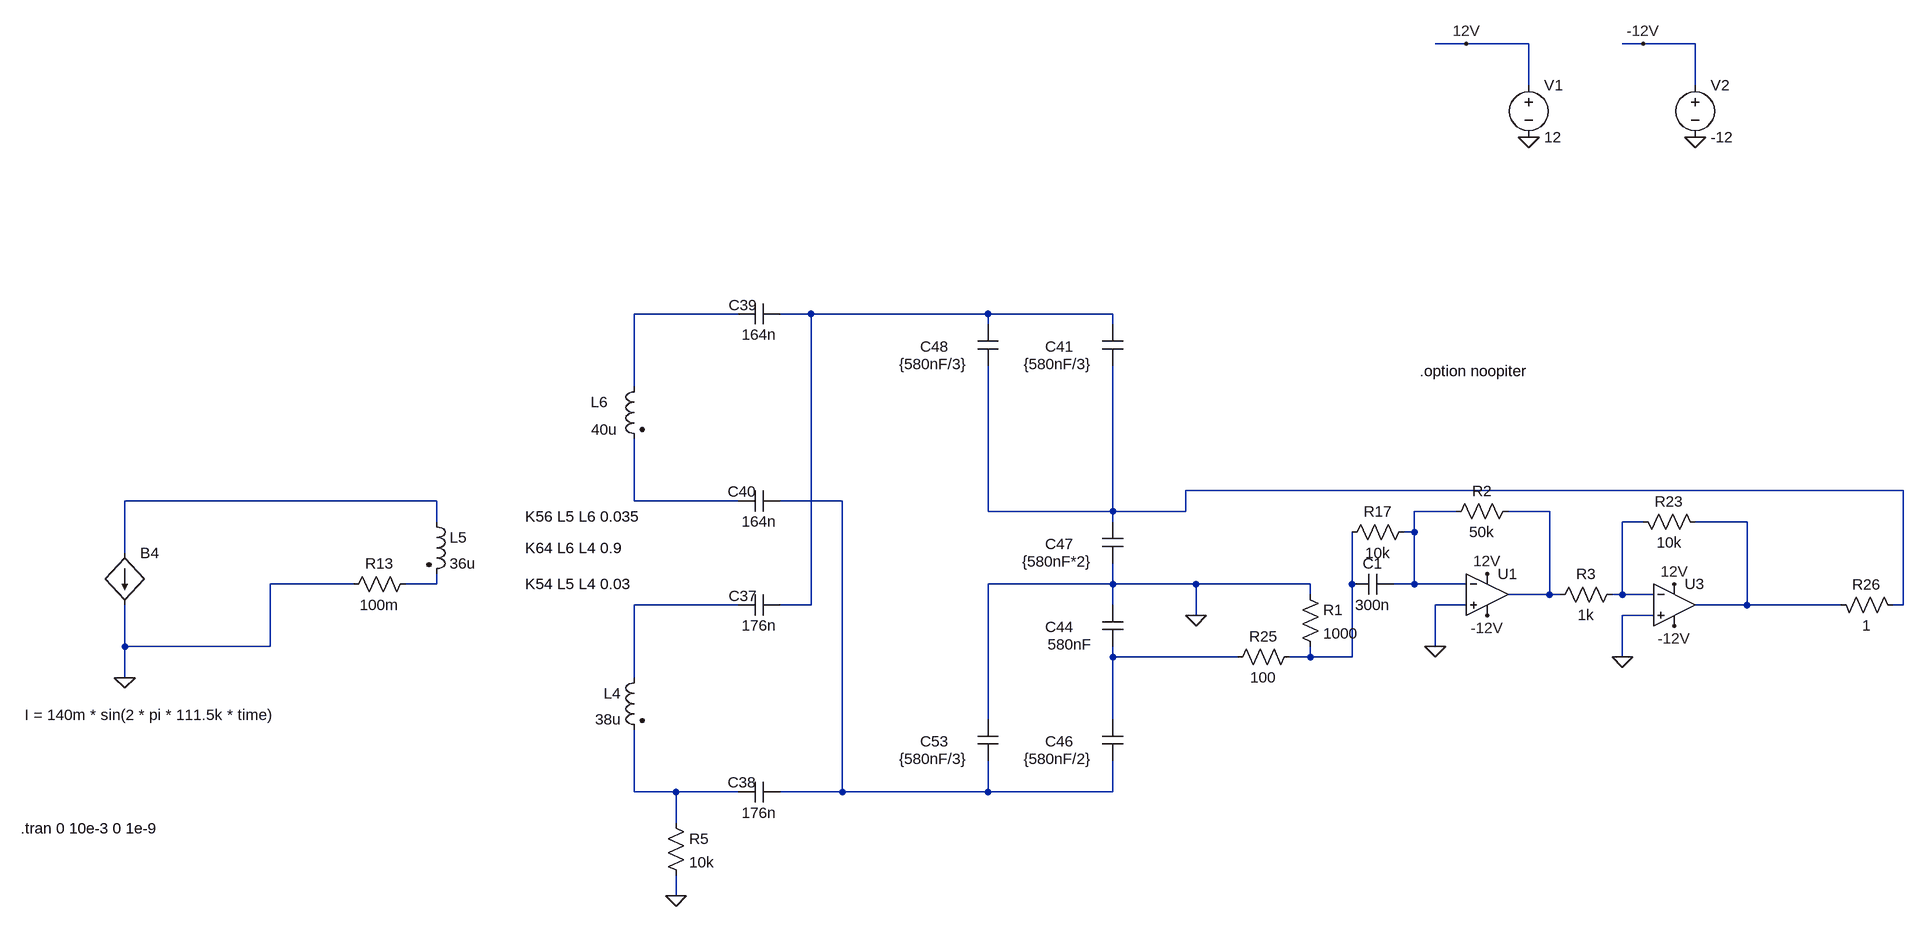
[diagram p0: schematic IMN_DIPS_CANCELATION_test.asc]
IMN_DIPS_CANCELATION_test.asc, the LTspice schematic file:
Version 4
SHEET 1 9932 3220
WIRE 3552 496 3504 496
WIRE 3648 496 3552 496
WIRE 3824 496 3792 496
WIRE 3904 496 3824 496
WIRE 3648 560 3648 496
WIRE 3904 560 3904 496
WIRE 2432 912 2272 912
WIRE 2544 912 2496 912
WIRE 2816 912 2544 912
WIRE 3008 912 2816 912
WIRE 2816 928 2816 912
WIRE 3008 928 3008 912
WIRE 2272 1024 2272 912
WIRE 4224 1184 3120 1184
WIRE 1968 1200 1488 1200
WIRE 2272 1200 2272 1104
WIRE 2432 1200 2272 1200
WIRE 2592 1200 2496 1200
WIRE 2816 1216 2816 992
WIRE 3008 1216 3008 992
WIRE 3008 1216 2816 1216
WIRE 3120 1216 3120 1184
WIRE 3120 1216 3008 1216
WIRE 3536 1216 3472 1216
WIRE 3680 1216 3616 1216
WIRE 1968 1232 1968 1200
WIRE 3008 1232 3008 1216
WIRE 3824 1232 3792 1232
WIRE 3984 1232 3904 1232
WIRE 3472 1248 3472 1216
WIRE 3472 1248 3456 1248
WIRE 1488 1280 1488 1200
WIRE 1840 1328 1712 1328
WIRE 1968 1328 1968 1312
WIRE 1968 1328 1920 1328
WIRE 3008 1328 3008 1296
WIRE 3008 1328 2816 1328
WIRE 3136 1328 3008 1328
WIRE 3312 1328 3136 1328
WIRE 3376 1328 3376 1248
WIRE 3472 1328 3472 1248
WIRE 3472 1328 3440 1328
WIRE 3552 1328 3472 1328
WIRE 3312 1344 3312 1328
WIRE 3680 1344 3680 1216
WIRE 3680 1344 3616 1344
WIRE 3696 1344 3680 1344
WIRE 3792 1344 3792 1232
WIRE 3792 1344 3776 1344
WIRE 3840 1344 3792 1344
WIRE 2432 1360 2272 1360
WIRE 2544 1360 2544 912
WIRE 2544 1360 2496 1360
WIRE 3008 1360 3008 1328
WIRE 3552 1360 3504 1360
WIRE 3984 1360 3984 1232
WIRE 3984 1360 3904 1360
WIRE 4128 1360 3984 1360
WIRE 4224 1360 4224 1184
WIRE 4224 1360 4208 1360
WIRE 3136 1376 3136 1328
WIRE 3840 1376 3792 1376
WIRE 1488 1424 1488 1360
WIRE 1712 1424 1712 1328
WIRE 1712 1424 1488 1424
WIRE 3504 1424 3504 1360
WIRE 3008 1440 3008 1424
WIRE 3200 1440 3008 1440
WIRE 3312 1440 3312 1424
WIRE 3312 1440 3280 1440
WIRE 3376 1440 3376 1328
WIRE 3376 1440 3312 1440
WIRE 3792 1440 3792 1376
WIRE 1488 1472 1488 1424
WIRE 2272 1472 2272 1360
WIRE 2816 1536 2816 1328
WIRE 3008 1536 3008 1440
WIRE 2272 1648 2272 1552
WIRE 2336 1648 2272 1648
WIRE 2432 1648 2336 1648
WIRE 2592 1648 2592 1200
WIRE 2592 1648 2496 1648
WIRE 2816 1648 2816 1600
WIRE 2816 1648 2592 1648
WIRE 3008 1648 3008 1600
WIRE 3008 1648 2816 1648
WIRE 2336 1696 2336 1648
WIRE 2336 1808 2336 1776
FLAG 1488 1472 0
FLAG 3792 1440 0
FLAG 3872 1328 12V
FLAG 3872 1392 -12V
FLAG 3504 1424 0
FLAG 3584 1312 12V
FLAG 3584 1376 -12V
FLAG 3648 640 0
FLAG 3904 640 0
FLAG 3552 496 12V
FLAG 3824 496 -12V
FLAG 3136 1376 0
FLAG 2336 1808 0
SYMBOL ind2 2288 1456 M0
SYMATTR Value 38u
SYMATTR InstName L4
SYMATTR Type ind
SYMATTR SpiceLine Rpar=1MEG
SYMBOL ind2 1952 1216 R0
SYMATTR InstName L5
SYMATTR Value 36u
SYMATTR Type ind
SYMATTR SpiceLine Rpar=1MEG
SYMBOL cap 2432 1376 R270
WINDOW 0 14 7 VTop 2
WINDOW 3 0 32 VBottom 2
SYMATTR InstName C37
SYMATTR Value 176n
SYMATTR SpiceLine Rser=3m
SYMBOL res 1936 1312 R90
WINDOW 0 0 56 VBottom 2
WINDOW 3 32 56 VTop 2
SYMATTR InstName R13
SYMATTR Value 100m
SYMBOL cap 2432 1664 R270
WINDOW 0 15 6 VTop 2
WINDOW 3 0 32 VBottom 2
SYMATTR InstName C38
SYMATTR Value 176n
SYMATTR SpiceLine Rser=3m
SYMBOL ind2 2288 1008 M0
WINDOW 3 42 82 Left 2
WINDOW 0 56 40 Left 2
SYMATTR Value 40u
SYMATTR InstName L6
SYMATTR Type ind
SYMATTR SpiceLine Rpar=1MEG
SYMBOL cap 2432 928 R270
WINDOW 0 14 7 VTop 2
WINDOW 3 0 32 VBottom 2
SYMATTR InstName C39
SYMATTR Value 164n
SYMATTR SpiceLine Rser=3m
SYMBOL cap 2432 1216 R270
WINDOW 0 15 6 VTop 2
WINDOW 3 0 32 VBottom 2
SYMATTR InstName C40
SYMATTR Value 164n
SYMATTR SpiceLine Rser=3m
SYMBOL cap 3024 992 R180
WINDOW 0 76 30 Left 2
WINDOW 3 47 3 Left 2
SYMATTR InstName C41
SYMATTR Value {580nF/3}
SYMATTR SpiceLine Rser=3m
SYMBOL cap 3024 1424 R180
WINDOW 0 76 30 Left 2
WINDOW 3 47 3 Left 2
SYMATTR InstName C44
SYMATTR Value 580nF
SYMATTR SpiceLine Rser=3m
SYMBOL cap 3024 1600 R180
WINDOW 0 76 30 Left 2
WINDOW 3 47 3 Left 2
SYMATTR InstName C46
SYMATTR Value {580nF/2}
SYMATTR SpiceLine Rser=3m
SYMBOL cap 3024 1296 R180
WINDOW 0 76 30 Left 2
WINDOW 3 47 3 Left 2
SYMATTR InstName C47
SYMATTR Value {580nF*2}
SYMATTR SpiceLine Rser=3m
SYMBOL cap 2832 992 R180
WINDOW 0 76 30 Left 2
WINDOW 3 47 3 Left 2
SYMATTR InstName C48
SYMATTR Value {580nF/3}
SYMATTR SpiceLine Rser=3m
SYMBOL cap 2832 1600 R180
WINDOW 0 76 30 Left 2
WINDOW 3 47 3 Left 2
SYMATTR InstName C53
SYMATTR Value {580nF/3}
SYMATTR SpiceLine Rser=3m
SYMBOL bi 1488 1280 R0
WINDOW 3 -154 249 Left 2
SYMATTR Value I = 140m * sin(2 * pi * 111.5k * time)
SYMATTR InstName B4
SYMBOL OpAmps\\UniversalOpAmp 3872 1360 R0
SYMATTR InstName U3
SYMBOL res 3808 1216 M90
WINDOW 0 0 56 VBottom 2
WINDOW 3 32 56 VTop 2
SYMATTR InstName R23
SYMATTR Value 10k
SYMBOL OpAmps\\UniversalOpAmp 3584 1344 R0
SYMATTR InstName U1
SYMBOL res 3296 1424 R90
WINDOW 0 0 56 VBottom 2
WINDOW 3 32 56 VTop 2
SYMATTR InstName R25
SYMATTR Value 100
SYMBOL res 4112 1344 M90
WINDOW 0 0 56 VBottom 2
WINDOW 3 32 56 VTop 2
SYMATTR InstName R26
SYMATTR Value 1
SYMBOL res 3296 1328 R0
SYMATTR InstName R1
SYMATTR Value 1000
SYMBOL cap 3440 1312 R90
WINDOW 0 0 32 VBottom 2
WINDOW 3 32 32 VTop 2
SYMATTR InstName C1
SYMATTR Value 300n
SYMBOL res 3632 1200 R90
WINDOW 0 0 56 VBottom 2
WINDOW 3 32 56 VTop 2
SYMATTR InstName R2
SYMATTR Value 50k
SYMBOL res 3792 1328 R90
WINDOW 0 0 56 VBottom 2
WINDOW 3 32 56 VTop 2
SYMATTR InstName R3
SYMATTR Value 1k
SYMBOL voltage 3648 544 R0
SYMATTR InstName V1
SYMATTR Value 12
SYMBOL voltage 3904 544 R0
SYMATTR InstName V2
SYMATTR Value -12
SYMBOL res 3472 1232 R90
WINDOW 0 0 56 VBottom 2
WINDOW 3 32 56 VTop 2
SYMATTR InstName R17
SYMATTR Value 10k
SYMBOL res 2320 1680 R0
SYMATTR InstName R5
SYMATTR Value 10k
TEXT 2104 1272 Left 2 !K64 L6 L4 0.9
TEXT 2104 1224 Left 2 !K56 L5 L6 0.035
TEXT 2104 1328 Left 2 !K54 L5 L4 0.03
TEXT 1328 1704 Left 2 !.tran 0 10e-3 0 1e-9
TEXT 3480 1000 Left 2 !.option noopiter

The netlist it stands for:
* IMN_DIPS_CANCELATION_test.asc
L4 N013 N015 38u Rpar=1MEG
L5 N004 N011 36u Rpar=1MEG
C37 N013 N002 176n Rser=3m
R13 N011 0 100m
C38 N015 N006 176n Rser=3m
L6 N001 N005 40u Rpar=1MEG
C39 N001 N002 164n Rser=3m
C40 N005 N006 164n Rser=3m
C41 N003 N002 {580nF/3} Rser=3m
C44 N014 0 580nF Rser=3m
C46 N006 N014 {580nF/2} Rser=3m
C47 0 N003 {580nF*2} Rser=3m
C48 N003 N002 {580nF/3} Rser=3m
C53 N006 0 {580nF/3} Rser=3m
B4 N004 0 I = 140m * sin(2 * pi * 111.5k * time)
XU3 0 N009 12V -12V N010 level1 Avol=1Meg GBW=10Meg Vos=0 En=0 Enk=0 In=0 Ink=0 Rin=500Meg  ; pins In+ In- V+ V- OUT
R23 N009 N010 10k
XU1 0 N007 12V -12V N008 level1 Avol=1Meg GBW=10Meg Vos=0 En=0 Enk=0 In=0 Ink=0 Rin=500Meg  ; pins In+ In- V+ V- OUT
R25 N012 N014 100
R26 N010 N003 1
R1 0 N012 1000
C1 N007 N012 300n
R2 N008 N007 50k
R3 N009 N008 1k
V1 12V 0 12
V2 -12V 0 -12
R17 N007 N012 10k
R5 N015 0 10k
K64 L6 L4 0.9
K56 L5 L6 0.035
K54 L5 L4 0.03
.tran 0 10e-3 0 1e-9
.option noopiter
.lib UniversalOpAmp1.lib
.backanno
.end